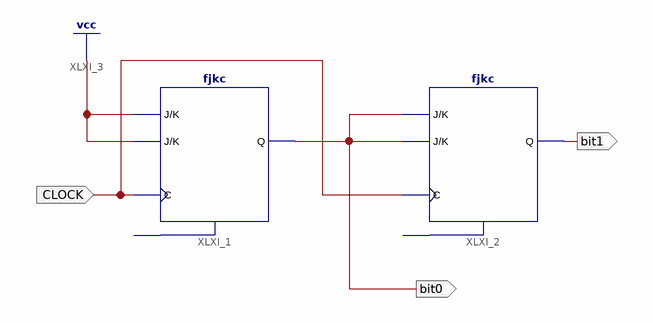
[diagram p0: schematic sheet 1]
// Xilinx ISE schematic counter03.sch (spartan6) as structural Verilog: 2 symbols, 3 ports
module counter03 (
  input  CLOCK,
  output bit0,
  output bit1
);

  fjkc XLXI_1 (.C(CLOCK), .J(1'b1), .K(1'b1), .Q(bit0));  // open: CLR
  fjkc XLXI_2 (.C(CLOCK), .J(bit0), .K(bit0), .Q(bit1));  // open: CLR
endmodule
